# EAGLE schematic LPC_2TE_3.3 (EAGLE 5.00)
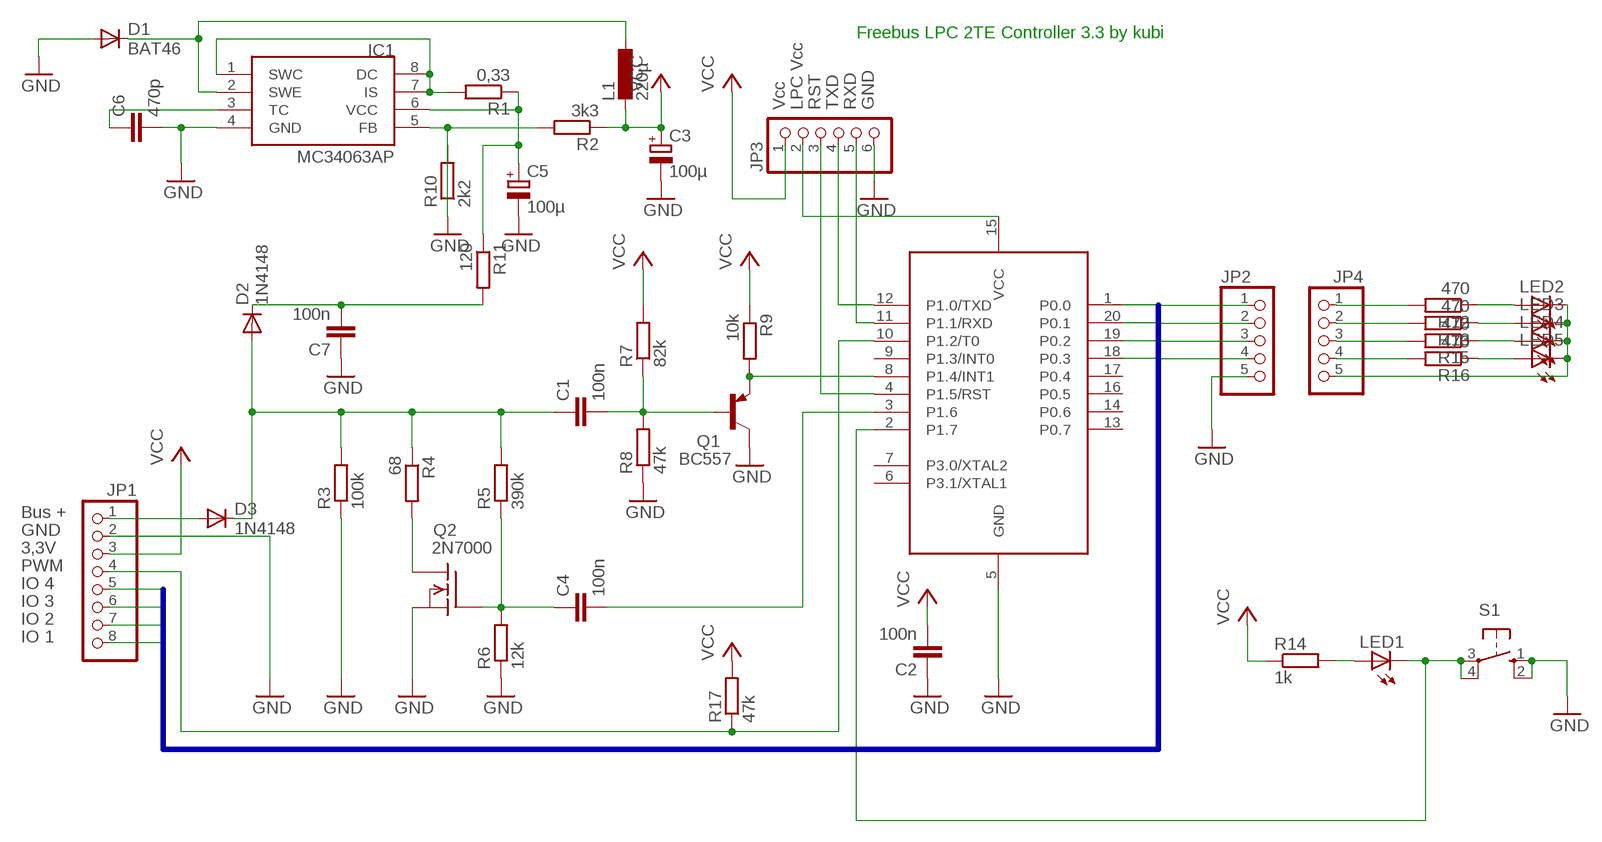
[diagram p0: schematic, sheet 1]

## Parts
C1  100n  C-EU050-024X044  [C050-024X044]
C2  100n  C-EU050-024X044  [C050-024X044]
C3  100µ  CPOL-EUE3.5-8  [E3,5-8]
C4  100n  C-EU050-024X044  [C050-024X044]
C5  100µ  CPOL-EUE3.5-8  [E3,5-8]
C6  470p  C-EU025-024X044  [C025-024X044]
C7  100n  C-EU050-024X044  [C050-024X044]
D1  BAT46  BAT81  [DO34-7]
D2  1N4148  [DO35-10]
D3  1N4148  [DO35-10]
IC1  MC34063AP  [DIL08]
JP1  PINHD-1X8  [1X08]
JP2  PINHD-1X5  [1X05]
JP3  PINHD-1X6  [1X06]
JP4  PINHD-1X5  [1X05]
L1  220µ  L-EU0207/2V  [0207/2V]
LED1  LED3MM  [LED3MM]
LED2  LED3MM  [LED3MM]
LED3  LED3MM  [LED3MM]
LED4  LED3MM  [LED3MM]
LED5  LED3MM  [LED3MM]
Q1  BC557  [TO92]
Q2  2N7000  VN2222KM  [TO237]
R1  0,33  R-EU_0207/2V  [0207/2V@1]
R2  3k3  R-EU_0207/2V  [0207/2V@1]
R3  100k  R-EU_0207/2V  [0207/2V@1]
R4  68  R-EU_0207/2V  [0207/2V@1]
R5  390k  R-EU_0207/2V  [0207/2V@1]
R6  12k  R-EU_0207/2V  [0207/2V@1]
R7  82k  R-EU_0207/2V  [0207/2V@1]
R8  47k  R-EU_0207/2V  [0207/2V@1]
R9  10k  R-EU_0207/2V  [0207/2V@1]
R10  2k2  R-EU_0207/2V  [0207/2V@1]
R11  120  R-EU_0207/2V  [0207/2V@1]
R12  470  R-EU_0207/10  [0207/10@1]
R13  470  R-EU_0207/10  [0207/10@1]
R14  1k  R-EU_0207/2V  [0207/2V@1]
R15  470  R-EU_0207/10  [0207/10@1]
R16  470  R-EU_0207/10  [0207/10@1]
R17  47k  R-EU_0207/2V  [0207/2V@1]
S1  10-XX  [B3F-10XX]
U1  89LPC922  [DIL20]

## Nets
GND: C2.1 C3.- C5.- C6.2 C7.1 D1.A IC1.4(GND) JP1.2 JP2.5 JP3.6 Q1.3(C) Q2.3(S) R3.1 R6.1 R8.1 R10.2 S1.1(S) S1.2(S1) U1.5(GND)
N$1: Q1.1(E) R9.2 U1.8(P1.4/INT1)
N$2: C1.2 Q1.2(B) R7.1 R8.2
N$3: JP1.4 R17.1 U1.10(P1.2/T0)
N$4: C1.1 D2.A D3.C R3.2 R4.1 R5.2
N$5: C4.2 U1.3(P1.6)
N$6: Q2.1(D) R4.2
N$7: LED1.K(C) S1.3(P) S1.4(P1) U1.2(P1.7)
N$8: IC1.1(SWC) IC1.7(IS) IC1.8(DC) R1.2
N$9: LED1.A R14.2
N$10: C5.+ IC1.6(VCC) R1.1 R11.1
N$11: IC1.5(FB) R2.2 R10.1
N$12: D1.C IC1.2(SWE) L1.1
N$13: C7.2 D2.C R11.2
N$14: C6.1 IC1.3(TC)
N$15: D3.A JP1.1
N$16: JP4.1 R12.2
N$17: JP4.2 R13.2
N$18: JP4.3 R15.2
N$19: JP4.4 R16.2
N$20: LED2.A R12.1
N$21: LED3.A R13.1
N$22: LED4.A R15.1
N$23: LED5.A R16.1
N$24: JP4.5 LED2.K(C) LED3.K(C) LED4.K(C) LED5.K(C)
N$29: JP3.4 U1.12(P1.0/TXD)
N$30: JP3.5 U1.11(P1.1/RXD)
N$31: JP3.3 U1.4(P1.5/RST)
N$32: JP3.2 U1.15(VCC)
N$34: C4.1 Q2.2(G) R5.1 R6.2
P0.0: JP1.8 JP2.1 U1.1(P0.0)
P0.1: JP1.7 JP2.2 U1.20(P0.1)
P0.2: JP1.6 JP2.3 U1.19(P0.2)
P0.3: JP1.5 JP2.4 U1.18(P0.3)
VCC: C2.2 C3.+ JP1.3 JP3.1 L1.2 R2.1 R7.2 R9.1 R14.1 R17.2
Unconnected: U1.6(P3.1/XTAL1) U1.7(P3.0/XTAL2) U1.9(P1.3/INT0) U1.13(P0.7) U1.14(P0.6) U1.16(P0.5) U1.17(P0.4)

## Buses
P0.[0..3]

## Notes on the sheet
- Freebus LPC 2TE Controller 3.3 by kubi
- Vcc | LPC Vcc | RST | TXD | RXD | GND
- Bus +
- GND
- 3,3V
- PWM
- IO 4
- IO 3
- IO 2
- IO 1

## Library data of the parts
C1 C2 C4 C6 C7 = rcl:C-EU: CAPACITOR, European symbol
C3 C5 = rcl:CPOL-EU: POLARIZED CAPACITOR, European symbol
D1 = diode:BAT81: DIODE barrier diode
D2 D3 = diode:1N4148: DIODE high speed (Philips)
IC1 = mc34063:MC34063
JP1 = pinhead:PINHD-1X8: PIN HEADER
JP2 JP4 = pinhead:PINHD-1X5: PIN HEADER
JP3 = pinhead:PINHD-1X6: PIN HEADER
L1 = rcl:L-EU: INDUCTOR, European symbol
LED1-LED5 = led:LED: LED OSRAM: - CHIPLED LG R971, LG N971, LY N971, LG Q971, LY Q971, LO R971, LY R971 LH N974, LH R974 LS Q976, LO Q976, LY Q976 LO Q996 - Hyper CHIPLED LW Q18S LB Q993, LB Q99A, LB R99A - SideLED LS A670, LO A670, LY A670, LG A670, LP A670 LB A673, LV A673, LT A673, LW A673 LH A674 LY A675 LS A676, LA A676, LO A676, LY A676, LW A676 LS A679, LY A679, LG A679 - Hyper Micro SIDELED® LS Y876, LA Y876, LO Y876, LY Y876 LT Y87S - SmartLED LW L88C, LW L88S LB L89C, LB L89S, LG L890 LS L89K, LO L89K, LY L89K LS L896, LA L896, LO L896, LY L896 - TOPLED LS T670, LO T670, LY T670, LG T670, LP T670 LSG T670, LSP T670, LSY T670, LOP T670, LYG T670 LG T671, LOG T671, LSG T671 LB T673, LV T673, LT T673, LW T673 LH T674 LS T676, LA T676, LO T676, LY T676, LB T676, LH T676, LSB T676, LW T676 LB T67C, LV T67C, LT T67C, LS T67K, LO T67K, LY T67K, LW E67C LS E67B, LA E67B, LO E67B, LY E67B, LB E67C, LV E67C, LT E67C LW T67C LS T679, LY T679, LG T679 LS T770, LO T770, LY T770, LG T770, LP T770 LB T773, LV T773, LT T773, LW T773 LH T774 LS E675, LA E675, LY E675, LS T675 LS T776, LA T776, LO T776, LY T776, LB T776 LHGB T686 LT T68C, LB T68C - Hyper Mini TOPLED® LB M676 - Mini TOPLED Santana® LG M470 LS M47K, LO M47K, LY M47K Source: http://www.osram.convergy.de - LUMILED® LXK2-PW12-R00, LXK2-PW12-S00, LXK2-PW14-U00, LXK2-PW14-V00 LXK2-PM12-R00, LXK2-PM12-S00, LXK2-PM14-U00 LXK2-PE12-Q00, LXK2-PE12-R00, LXK2-PE12-S00, LXK2-PE14-T00, LXK2-PE14-U00 LXK2-PB12-K00, LXK2-PB12-L00, LXK2-PB12-M00, LXK2-PB14-N00, LXK2-PB14-P00, LXK2-PB14-Q00 LXK2-PR12-L00, LXK2-PR12-M00, LXK2-PR14-Q00, LXK2-PR14-R00 LXK2-PD12-Q00, LXK2-PD12-R00, LXK2-PD12-S00 LXK2-PH12-R00, LXK2-PH12-S00 LXK2-PL12-P00, LXK2-PL12-Q00, LXK2-PL12-R00 Source: www.luxeon.com
Q1 = transistor-pnp:BC557: PNP Transistor
Q2 = transistor-fet:VN2222KM: N-Channel Enhancement MOSFET (VMOS); 60V; 0,5A; 7,5Ohm
R1-R17 = rcl:R-EU_: RESISTOR, European symbol
S1 = switch-omron:10-XX: OMRON SWITCH
U1 = micro-philips:89LPC922